# EasyEDA schematic Prática-03.json
TITLE: Sheet_1; REV: 1.0; Date: 2020-09-02; Sheet: 1/1; Company: Your Company
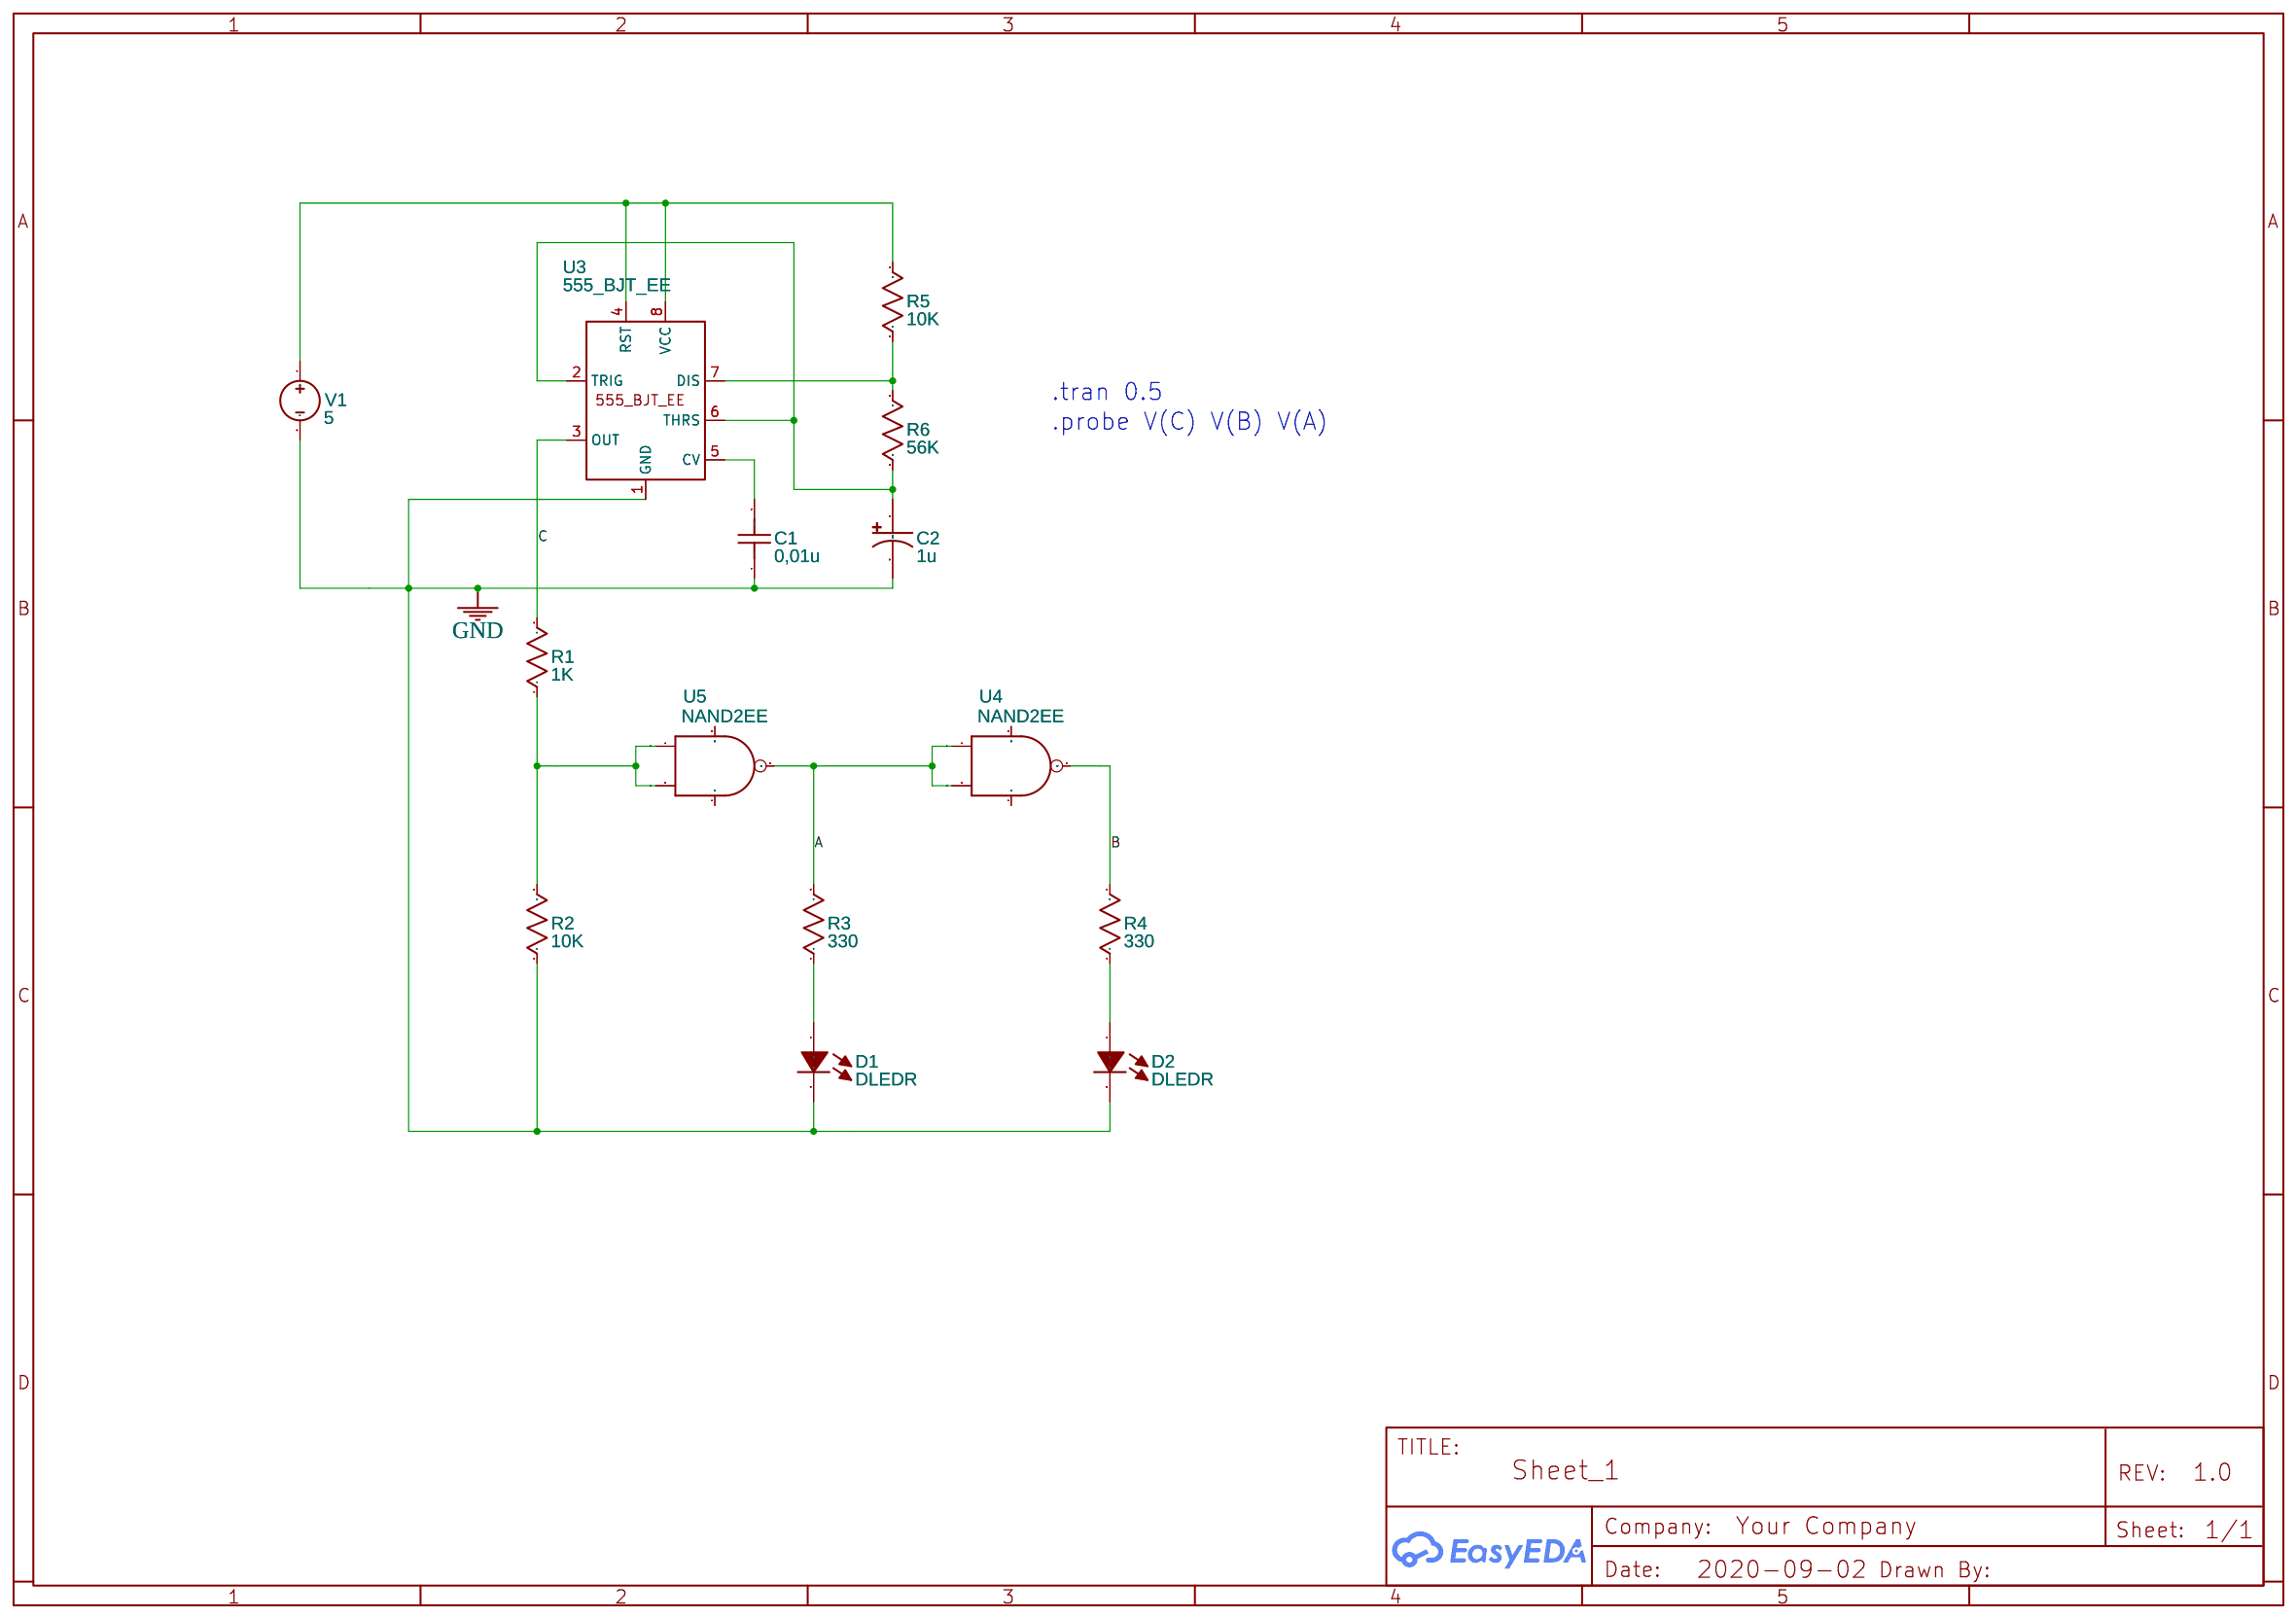
[diagram p0: schematic sheet]

## Parts
C1  0,01u  [RAD-0.1]
C2  1u  [CAP-D3.0XF1.5]
D1  DLEDR  [LED3MM]
D2  DLEDR  [LED3MM]
R1  1K  [AXIAL-0.3]
R2  10K  [AXIAL-0.3]
R3  330  [AXIAL-0.3]
R4  330  [AXIAL-0.3]
R5  10K  [AXIAL-0.3]
R6  56K  [AXIAL-0.3]
U3  555_BJT_EE  [DIP8]
U4  NAND2EE
U5  NAND2EE
V1  5  [HDR1X2]

## Library data of the parts
C1 = Capacitor_US: Contributor: EasyEDA; Supplier: YUJING; Capacitance: 1u
C2 = Capacitor_Electrolytic_US: Supplier: YUJING; Contributor: EasyEDA
D1 D2 = DLEDR: sourceId: 39lVhsq0A; sim: true
R1-R6 = Resistor_US: Resistance: 1k; Contributor: EasyEDA; Supplier: YUJING
U3 = 555_BJT_EE: Contributor: EasyEDA; link: http://www.ti.com/lit/ds/symlink/ne555.pdf
U4 U5 = LOGIC: Contributor: EasyEDA
V1 = VDC: Contributor: EasyEDA; sim: true

## Nets
GND: C1.1 C2.2 D1.2(C) D2.2(C) R2.1 U3.1(GND) V1.2
A: R3.2 U4.1(INA) U4.2(INB) U5.5(OUT)
B: R4.2 U4.5(OUT)
C: R1.2 U3.3(OUT)
Net-(C1-2): C1.2 U3.5(CV)
Net-(C2-1): C2.1 R6.1 U3.2(TRIG) U3.6(THRS)
Net-(D1-1): D1.1(A) R3.1
Net-(D2-1): D2.1(A) R4.1
Net-(R1-1): R1.1 R2.2 U5.1(INA) U5.2(INB)
Net-(R5-1): R5.1 R6.2 U3.7(DIS)
Net-(R5-2): R5.2 U3.4(RST) U3.8(VCC) V1.1

Not connected (* = marked no-connect by the designer): U4 3(VDD) 4(GND); U5 3(VDD) 4(GND)

## Notes on the sheet
- .tran 0.5
- .probe V(C) V(B) V(A)
